# Altium schematic sheet 2.ETH.SchDoc
size A3
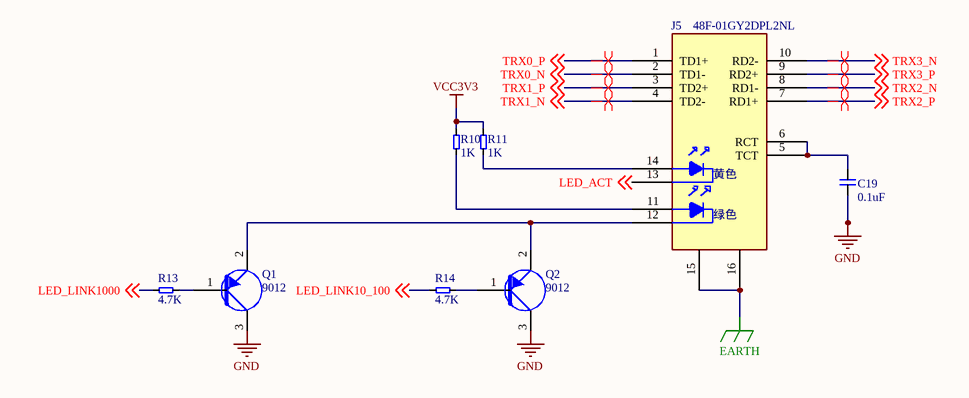
[diagram p0: 2.ETH.SchDoc]

## Parts
C19  0.1uF  [0603C]
J5  48F-01GY2DPL2NL  [RJ45C-48F-01GY2DPL2NL]
Q1  9012  [SOT-23-PMOS]
Q2  9012  [SOT-23-PMOS]
R10  1K  [0603R]
R11  1K  [0603R]
R13  4.7K  [0603R]
R14  4.7K  [0603R]

## Nets
EARTH: J5.15 J5.16
GND: C19.2 Q1.3 Q2.3
VCC3V3: R10.2 R11.2
LED_ACT: J5.13 ; off-sheet LED_ACT
LED_LINK10_100: R14.2 ; off-sheet LED_LINK10_100
LED_LINK1000: R13.2 ; off-sheet LED_LINK1000
TRX0_N: J5.2(TD1-) ; off-sheet TRX0_N
TRX0_P: J5.1(TD1+) ; off-sheet TRX0_P
TRX1_N: J5.4(TD2-) ; off-sheet TRX1_N
TRX1_P: J5.3(TD2+) ; off-sheet TRX1_P
TRX2_N: J5.8(RD1-) ; off-sheet TRX2_N
TRX2_P: J5.7(RD1+) ; off-sheet TRX2_P
TRX3_N: J5.10(RD2-) ; off-sheet TRX3_N
TRX3_P: J5.9(RD2+) ; off-sheet TRX3_P
NetC19_1: C19.1 J5.5(TCT) J5.6(RCT)
NetJ5_11: J5.11 R10.1
NetJ5_12: J5.12 Q1.2 Q2.2
NetJ5_14: J5.14 R11.1
NetQ1_1: Q1.1 R13.1
NetQ2_1: Q2.1 R14.1

## Layout directives
differential pair: TRX0_N, TRX0_P, TRX1_N, TRX1_P, TRX2_N, TRX2_P, TRX3_N, TRX3_P

## Notes on the sheet
- (in symbol 48F-01GY2DPL2NL) 黄色; 绿色

## Library data of the parts
C19 = 电容
R10 R11 R13 R14 = 电阻